# Altium schematic sheet oscillator.SchDoc
size A4
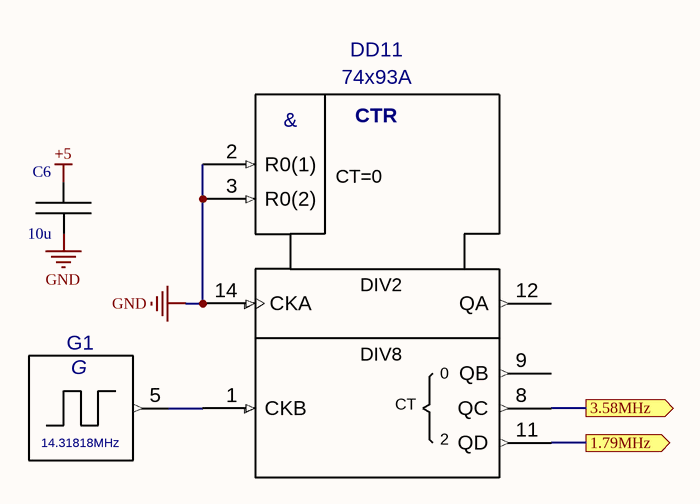
[diagram p0: oscillator.SchDoc]

## Parts
C6  10u  [CAP 5.5x3.15]
DD11  74x93A  [DIP14]
G1  Frequency: 14.31818MHz  [DIP8 CXO]  (hidden comment: CXO)

## Ports
1.79MHz (out), 3.58MHz (out)

## Nets
+5: C6.2 DD11.5(+5)
GND: C6.1 DD11.2(R0(1)) DD11.3(R0(2)) DD11.10(GND) DD11.14(CKA)
1.79MHz: DD11.11(QD) ; port 1.79MHz
3.58MHz: DD11.8(QC) ; port 3.58MHz
NetDD11_1: DD11.1(CKB) G1.5

Not connected (* = marked no-connect by the designer): DD11 4(N.C.) 6(N.C.) 7(N.C.) 9(QB) 12(QA) 13(N.C.); G1 1(N.C.) 4(GND) 8(+5)

## Notes on the sheet
- (in symbol 74x93A IEEE) CTR; &; CT=0; DIV2; DIV8; 0; CT
- (in symbol CXO) G

## Library data of the parts
C6 = Cap: Murata ceramic capacitor
DD11 = 74x93A IEEE: ИЕ5; Value: *